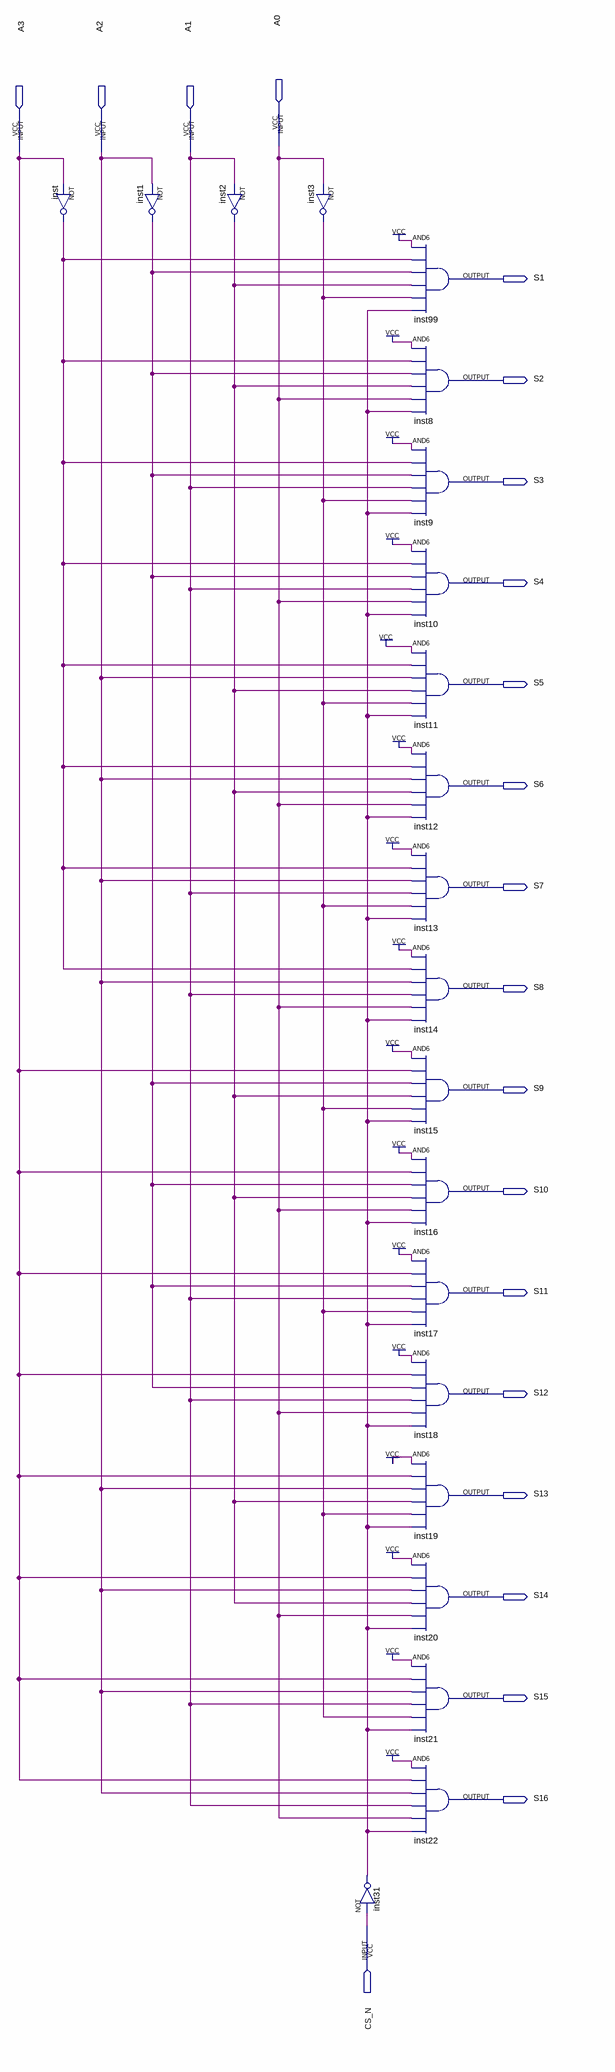
[diagram p0: schematic sheet]
// Quartus schematic CI74F189_DECODIFICADOR.bdf as structural Verilog: 21 symbols, 21 pins
module CI74F189_DECODIFICADOR (
  input  A0,
  input  A3,
  input  A2,
  input  A1,
  input  CS_N,
  output S1,
  output S2,
  output S3,
  output S4,
  output S5,
  output S6,
  output S7,
  output S8,
  output S9,
  output S10,
  output S11,
  output S12,
  output S13,
  output S14,
  output S15,
  output S16
);

  wire inst1_out, inst2_out, inst3_out, inst31_out, inst_out;

  not inst (inst_out, A3);
  not inst1 (inst1_out, A2);
  not inst2 (inst2_out, A1);
  not inst3 (inst3_out, A0);
  not inst31 (inst31_out, CS_N);
  and inst99 (S1, 1'b1, inst_out, inst1_out, inst2_out, inst3_out, inst31_out);
  and inst8 (S2, 1'b1, inst_out, inst1_out, inst2_out, A0, inst31_out);
  and inst9 (S3, 1'b1, inst_out, inst1_out, A1, inst3_out, inst31_out);
  and inst10 (S4, 1'b1, inst_out, inst1_out, A1, A0, inst31_out);
  and inst11 (S5, 1'b1, inst_out, A2, inst2_out, inst3_out, inst31_out);
  and inst12 (S6, 1'b1, inst_out, A2, inst2_out, A0, inst31_out);
  and inst13 (S7, 1'b1, inst_out, A2, A1, inst3_out, inst31_out);
  and inst14 (S8, 1'b1, inst_out, A2, A1, A0, inst31_out);
  and inst15 (S9, 1'b1, A3, inst1_out, inst2_out, inst3_out, inst31_out);
  and inst16 (S10, 1'b1, A3, inst1_out, inst2_out, A0, inst31_out);
  and inst17 (S11, 1'b1, A3, inst1_out, A1, inst3_out, inst31_out);
  and inst18 (S12, 1'b1, A3, inst1_out, A1, A0, inst31_out);
  and inst19 (S13, 1'b1, A3, A2, inst2_out, inst3_out, inst31_out);
  and inst20 (S14, 1'b1, A3, A2, inst2_out, A0, inst31_out);
  and inst21 (S15, 1'b1, A3, A2, A1, inst3_out, inst31_out);
  and inst22 (S16, 1'b1, A3, A2, A1, A0, inst31_out);
endmodule
